# EAGLE design MotorBoard (EAGLE 9.0.0)
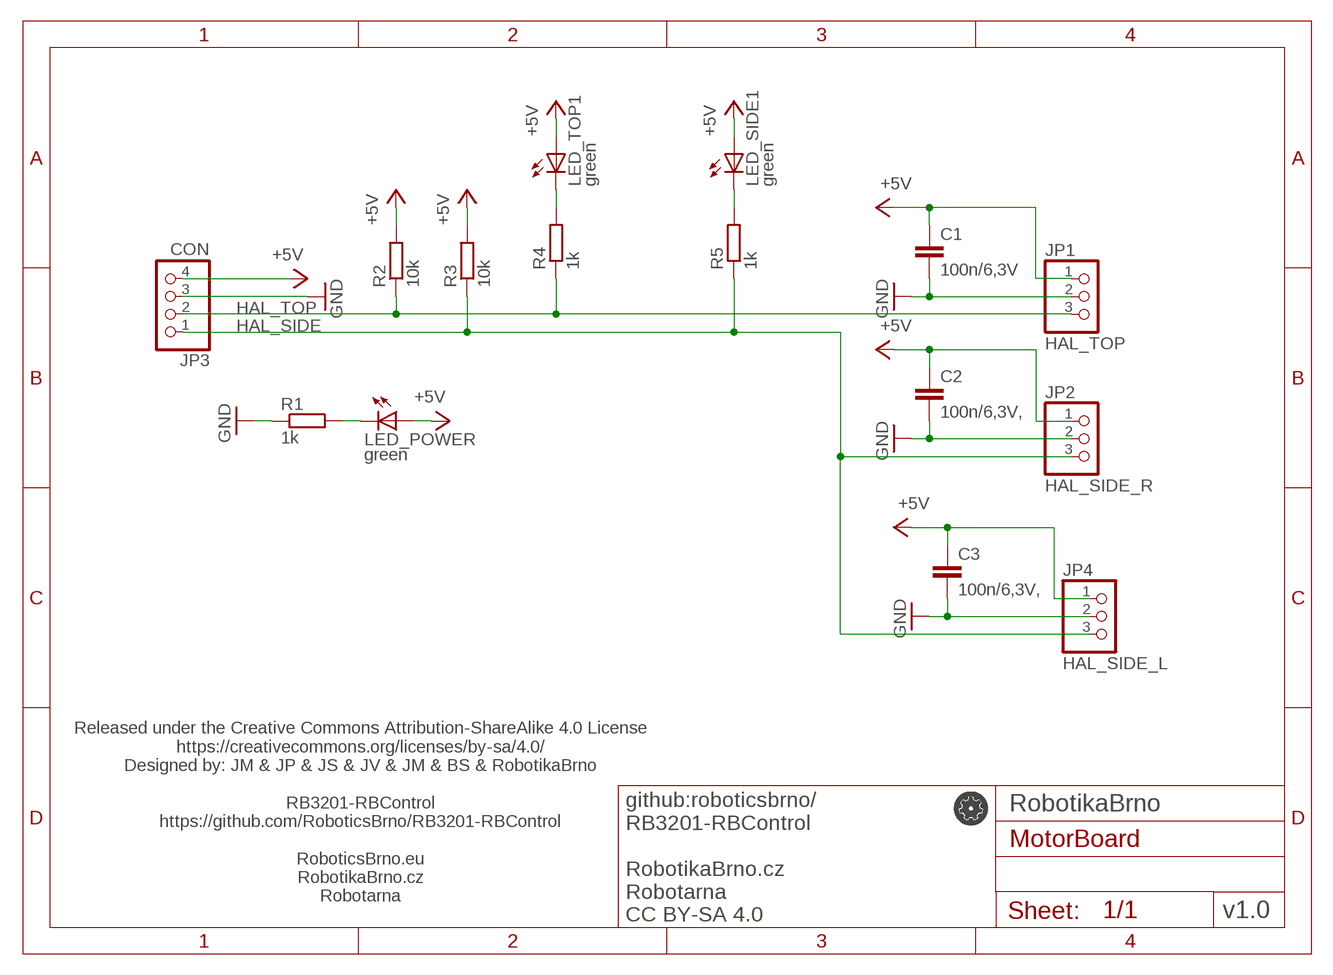
[diagram p0: schematic, sheet 1]

## Parts
C1  100n/6,3V  C-EUC0603  [C0603]
C2  100n/6,3V,  C-EUC0603  [C0603]
C3  100n/6,3V,  C-EUC0603  [C0603]
JP1  HAL_TOP  PINHD-1X3/90  [1X03/90]
JP2  HAL_SIDE_R  PINHD-1X3/90  [1X03/90]
JP3  CON  PINHD-1X4/90  [1X04/90]
JP4  HAL_SIDE_L  PINHD-1X3/90  [1X03/90]
LED_POWER  green  LEDCHIPLED_0603  [CHIPLED_0603]
LED_SIDE1  green  LEDCHIPLED_0603  [CHIPLED_0603]
LED_TOP1  green  LEDCHIPLED_0603  [CHIPLED_0603]
R1  1k  R-EU_R0603  [R0603]
R2  10k  R-EU_R0603  [R0603]
R3  10k  R-EU_R0603  [R0603]
R4  1k  R-EU_R0603  [R0603]
R5  1k  R-EU_R0603  [R0603]

## Nets
+5V: C1.1 C2.1 C3.1 JP1.1 JP2.1 JP3.4 JP4.1 LED_POWER.A LED_SIDE1.A LED_TOP1.A R2.2 R3.2
GND: C1.2 C2.2 C3.2 JP1.2 JP2.2 JP3.3 JP4.2 R1.1
HAL_SIDE: JP2.3 JP3.1 JP4.3 R3.1 R5.1
HAL_TOP: JP1.3 JP3.2 R2.1 R4.1
LED_POWER: LED_POWER.C R1.2
LED_SIDE1: LED_SIDE1.C R5.2
LED_TOP1: LED_TOP1.C R4.2

## Notes on the sheet
- Released under the Creative Commons Attribution-ShareAlike 4.0 License
  https://creativecommons.org/licenses/by-sa/4.0/
  Designed by: JM & JP & JS & JV & JM & BS & RobotikaBrno
  
  RB3201-RBControl
  https://github.com/RoboticsBrno/RB3201-RBControl
  
  RoboticsBrno.eu
  RobotikaBrno.cz
  Robotarna
- RobotikaBrno
- v1.0
- github:roboticsbrno/
  RB3201-RBControl
  
  RobotikaBrno.cz
  Robotarna
  CC BY-SA 4.0

## Library data of the parts
C1-C3 = rcl:C-EU: CAPACITOR, European symbol; SPICEPREFIX: C
JP1 JP2 JP4 = pinhead:PINHD-1X3: PIN HEADER
JP3 = pinhead:PINHD-1X4: PIN HEADER
LED_POWER LED_SIDE1 LED_TOP1 = led:LED: LED OSRAM: - CHIPLED LG R971, LG N971, LY N971, LG Q971, LY Q971, LO R971, LY R971 LH N974, LH R974 LS Q976, LO Q976, LY Q976 LO Q996 - Hyper CHIPLED LW Q18S LB Q993, LB Q99A, LB R99A - SideLED LS A670, LO A670, LY A670, LG A670, LP A670 LB A673, LV A673, LT A673, LW A673 LH A674 LY A675 LS A676, LA A676, LO A676, LY A676, LW A676 LS A679, LY A679, LG A679 - Hyper Micro SIDELED® LS Y876, LA Y876, LO Y876, LY Y876 LT Y87S - SmartLED LW L88C, LW L88S LB L89C, LB L89S, LG L890 LS L89K, LO L89K, LY L89K LS L896, LA L896, LO L896, LY L896 - TOPLED LS T670, LO T670, LY T670, LG T670, LP T670 LSG T670, LSP T670, LSY T670, LOP T670, LYG T670 LG T671, LOG T671, LSG T671 LB T673, LV T673, LT T673, LW T673 LH T674 LS T676, LA T676, LO T676, LY T676, LB T676, LH T676, LSB T676, LW T676 LB T67C, LV T67C, LT T67C, LS T67K, LO T67K, LY T67K, LW E67C LS E67B, LA E67B, LO E67B, LY E67B, LB E67C, LV E67C, LT E67C LW T67C LS T679, LY T679, LG T679 LS T770, LO T770, LY T770, LG T770, LP T770 LB T773, LV T773, LT T773, LW T773 LH T774 LS E675, LA E675, LY E675, LS T675 LS T776, LA T776, LO T776, LY T776, LB T776 LHGB T686 LT T68C, LB T68C - Hyper Mini TOPLED® LB M676 - Mini TOPLED Santana® LG M470 LS M47K, LO M47K, LY M47K Source: http://www.osram.convergy.de LUXEON: - LUMILED® LXK2-PW12-R00, LXK2-PW12-S00, LXK2-PW14-U00, LXK2-PW14-V00 LXK2-PM12-R00, LXK2-PM12-S00, LXK2-PM14-U00 LXK2-PE12-Q00, LXK2-PE12-R00, LXK2-PE12-S00, LXK2-PE14-T00, LXK2-PE14-U00 LXK2-PB12-K00, LXK2-PB12-L00, LXK2-PB12-M00, LXK2-PB14-N00, LXK2-PB14-P00, LXK2-PB14-Q00 LXK2-PR12-L00, LXK2-PR12-M00, LXK2-PR14-Q00, LXK2-PR14-R00 LXK2-PD12-Q00, LXK2-PD12-R00, LXK2-PD12-S00 LXK2-PH12-R00, LXK2-PH12-S00 LXK2-PL12-P00, LXK2-PL12-Q00, LXK2-PL12-R00 Source: www.luxeon.com KINGBRIGHT: KA-3528ASYC Source: www.kingbright.com; DIGIKEY: 160-1446-1-ND; FARNELL: 2293494; MOUSER: 859-LTST-C191KGKT; RS: 872-1799
R1-R5 = rcl:R-EU_: RESISTOR, European symbol; SPICEPREFIX: R

## Board
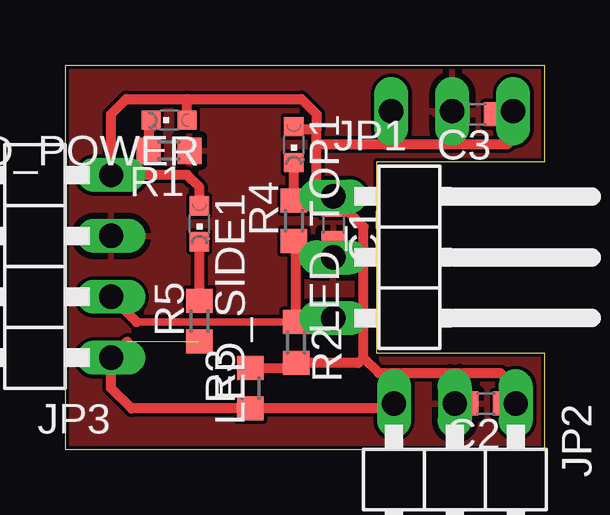
[diagram p1: board, top side]
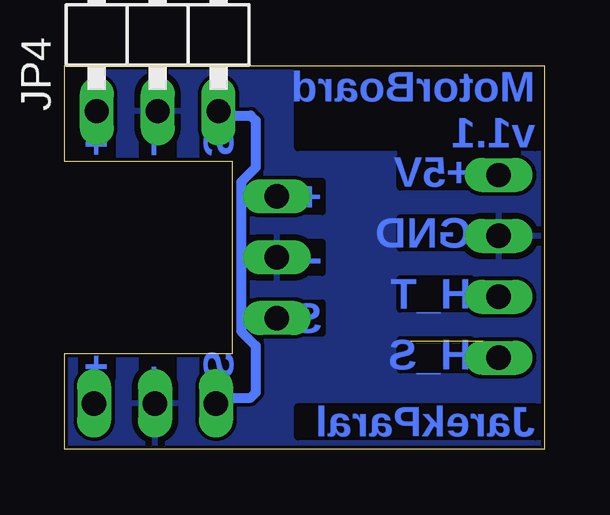
[diagram p2: board, bottom side, seen from below]

Size 20 x 16 mm. Coordinates in mm from the lower left corner, seen from the top.
Outline: 0,16 0,0 20,0 20,4 13,4 13,12 20,12 20,16 0,16
Copper layers (1*16): Top 0.035mm / dielectric 1.5mm / Bottom 0.035mm
Design rules "gatema_2layers": minimum track width 0.15mm, minimum drill 0.3mm, track to track 0.15mm, track to pad 0.15mm, pad to pad 0.15mm, via to via 0.15mm, smd to smd 0mil, copper to edge 0.15mm, drill to drill 0.4mm, minimum pad ring 0.2mm, minimum via ring 0.2mm, stop-mask expansion 2mil, vias tented up to drill 0.4mm, thermal gap 10mil

### Footprints (pad centres in the part's own frame; a part is rotated, then mirrored left to right if it is on the bottom)
C0603 = smd 1.1 x 1: 1 -0.85,0; 2 0.85,0
1X03/90 = drill 1.016 long: 1 -2.54,-3.81; 2 0,-3.81; 3 2.54,-3.81
1X04/90 = drill 1.016 long: 1 -3.81,-3.81; 2 -1.27,-3.81; 3 1.27,-3.81; 4 3.81,-3.81
CHIPLED_0603 = smd 0.8 x 0.8: A 0,-0.75; C 0,0.75
R0603 = smd 1 x 1.1: 1 -0.85,0; 2 0.85,0

### Placement (x,y rotation side)
C1  11.18,9.4 270 top
C2  17.53,1.91 180 top
C3  17.14,13.97 180 top
JP1  14.97,8 270 top
JP2  16.24,-1.91 180 top
JP3  -1.91,7.62 90 top
JP4  16.13,17.91 0 bottom
LED_POWER  4.32,13.72 90 top
LED_SIDE1  5.59,9.4 180 top
LED_TOP1  9.53,12.7 180 top
R1  4.32,12.45 180 top
R2  9.62,4.45 270 top
R3  7.71,2.54 90 top
R4  9.53,9.53 90 top
R5  5.59,5.33 90 top

### Tracks (layer width: path | path; a pad name or v marks a point on that pad's centre or on a via)
+5V
  Top 0.152: C1.1 11.18,10.52 JP1.1 | C2.1 JP2.1
  Top 0.406: 12.43,3.81 13.06,3.17 18.14,3.17 18.78,2.54 JP2.1 | 12.43,3.81 12.21,3.6 R2.2 9.41,3.39 R3.2 | 12.43,3.81 12.43,9.27 JP1.1 | 10.48,13.34 10.48,13.97 9.84,14.61 5.08,14.61 | LED_SIDE1.A 5.59,10.92 5.08,11.43 JP3.4 1.91,13.97 2.54,14.61 5.08,14.61 | LED_TOP1.A 9.64,13.34 10.48,13.34 | C1.1 10.48,10.95 10.48,12.7 | 10.48,12.7 10.48,13.34 | 10.48,12.7 18.41,12.7 18.67,12.95 JP4.1 18.54,13.97 C3.1 | LED_POWER.A 5.07,14.59 5.08,14.61
GND
  Top 0.152: C1.2 11.18,8.27 11.16,8.26
  Top 0.406: 11.16,8.26 JP1.2 | C2.2 JP2.2 | C3.2 16.26,13.97 JP4.2
  pour Top (isolate 0.127): 0,0 20.05,0 20.05,4.45 13.7,4.45 13.7,11.43 20.05,11.43 20.05,16.51 0,16.51
  pour Bottom: 0,0 20.05,0 20.05,4.45 13.7,4.45 13.7,11.43 20.05,11.43 20.05,16.51 0,16.51
HAL_SIDE  (1 unrouted)
  Top 0.406: JP2.3 13.48,1.69 R3.1 2.75,1.69 1.91,2.54 JP3.1 2.58,4.48
  Bottom 0.406: JP2.3 13.46,2.14 12.25,2.14 12.04,2.35 12.04,4.31 12.65,4.91 12.65,11.14 12.04,11.75 12.04,13.71 12.25,13.91 13.41,13.91 JP4.3
HAL_TOP
  Top 0.152: R4.1 9.53,8.35 9.62,8.26
  Top 0.305: R2.1 2.96,5.29
  Top 0.406: JP1.3 10.99,5.29 R2.1 9.62,8.26 9.62,8.58 | 2.96,5.29 JP3.2
LED_POWER
  Top 0.406: LED_POWER.C 3.47,13.62 R1.2
LED_SIDE1
  Top 0.406: R5.2 LED_SIDE1.C
LED_TOP1
  Top 0.406: R4.2 LED_TOP1.C

### Text on the board
Bottom: MotorBoard / v1.1 | S | - | + | +5V | + | GND | - | H_T | S | H_S | S | - | + | JarekParal
tDocu: v1.1 | MotorBoard | ON | S | - | + | + | H_T | H_S | S | - | + | JarekParal